# EAGLE schematic Led_Cube_v15 (EAGLE 9.7.0)
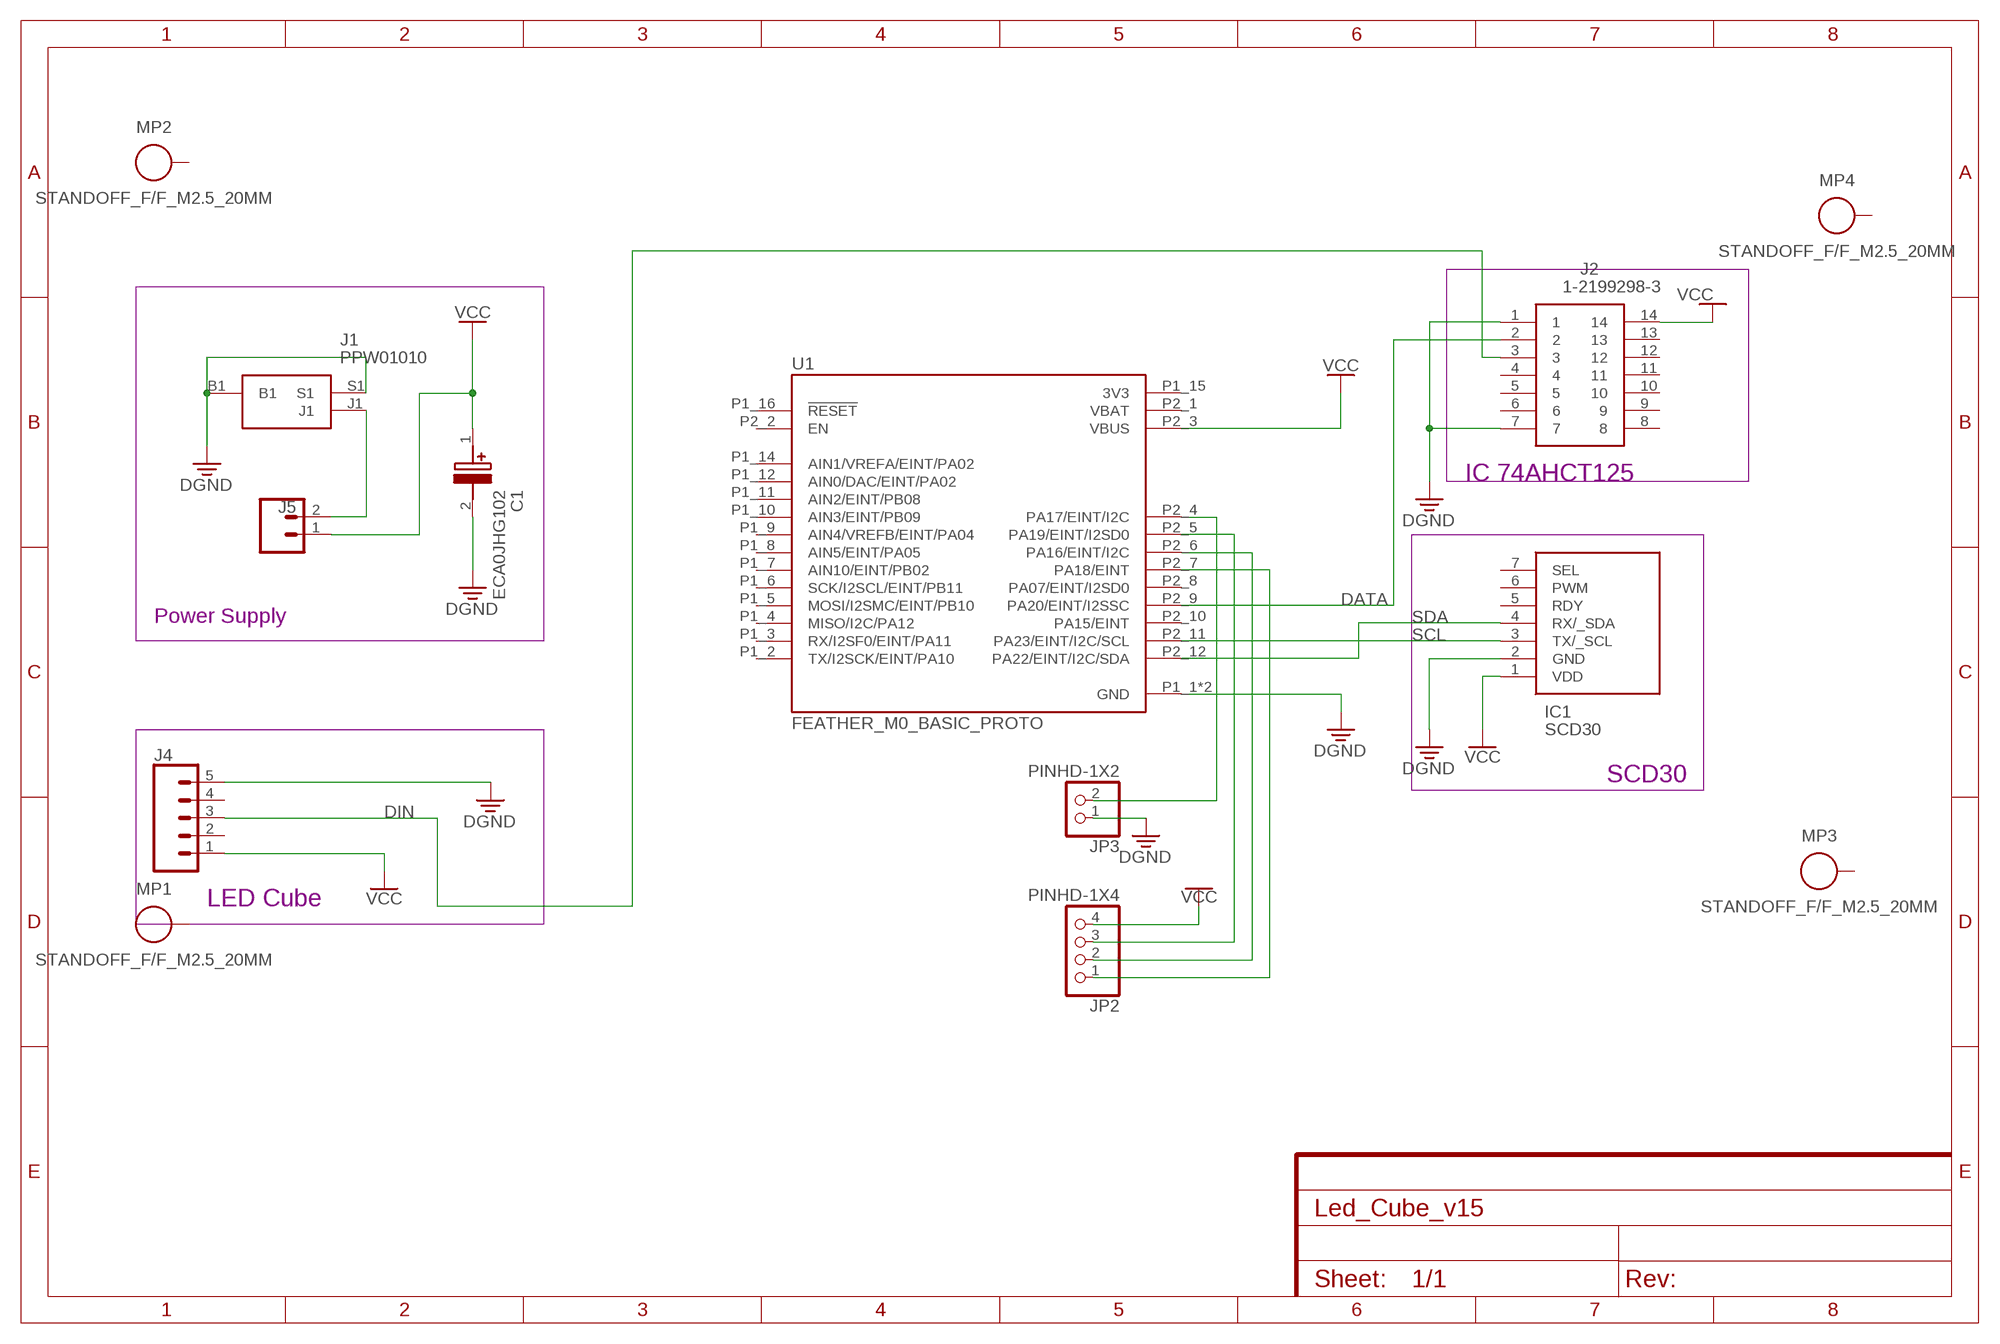
[diagram p0: schematic, sheet 1]

## Parts
C1  ECA0JHG102  [CAPPRD350W65D800H1250]
IC1  SCD30  [SCD30]
J1  PPW01010  [PPW01010]
J2  1-2199298-3  [DIPS762W70P254L1778H510Q14N]
J4  CONN_05PTH  [1X05]
J5  CONN_02  [1X02]
JP2  PINHD-1X4  [1X04]
JP3  PINHD-1X2  [1X02]
MP1  STANDOFF_F/F_M2.5_20MM  [STANDOFF_HEX_FEMALE_500X2000_M2.5X0.45_MTGP755H270]
MP2  STANDOFF_F/F_M2.5_20MM  [STANDOFF_HEX_FEMALE_500X2000_M2.5X0.45_MTGP755H270]
MP3  STANDOFF_F/F_M2.5_20MM  [STANDOFF_HEX_FEMALE_500X2000_M2.5X0.45_MTGP755H270]
MP4  STANDOFF_F/F_M2.5_20MM  [STANDOFF_HEX_FEMALE_500X2000_M2.5X0.45_MTGP755H270]
U1  FEATHER_M0_BASIC_PROTO  [MODULE_FEATHER_M0_BASIC_PROTO]

## Nets
BLUE: JP2.3 U1.P2_5(PA19/EINT/I2SD0)
DATA: J2.2 U1.P2_9(PA20/EINT/I2SSC)
DGND: C1.2(-) IC1.2(GND) J1.B1 J1.S1 J2.1 J2.7 J4.5 JP3.1 U1.P1_1(GND) U1.P1_13(GND)
DIN: J2.3 J4.3
GREEN: JP2.2 U1.P2_6(PA16/EINT/I2C)
N$4: J1.J1 J5.2
RED: JP2.1 U1.P2_7(PA18/EINT)
SCL: IC1.3(TX/_SCL) U1.P2_11(PA23/EINT/I2C/SCL)
SDA: IC1.4(RX/_SDA) U1.P2_12(PA22/EINT/I2C/SDA)
SW1: JP3.2 U1.P2_4(PA17/EINT/I2C)
VCC: C1.1(+) IC1.1(VDD) J2.14 J4.1 J5.1 JP2.4 U1.P2_3(VBUS)
Unconnected: IC1.5(RDY) IC1.6(PWM) IC1.7(SEL) J2.4 J2.5 J2.6 J2.8 J2.9 J2.10 J2.11 J2.12 J2.13 J4.2 J4.4 MP1.1 MP2.1 MP3.1 MP4.1 U1.P1_2(TX/I2SCK/EINT/PA10) U1.P1_3(RX/I2SF0/EINT/PA11) U1.P1_4(MISO/I2C/PA12) U1.P1_5(MOSI/I2SMC/EINT/PB10) U1.P1_6(SCK/I2SCL/EINT/PB11) U1.P1_7(AIN10/EINT/PB02) U1.P1_8(AIN5/EINT/PA05) U1.P1_9(AIN4/VREFB/EINT/PA04) U1.P1_10(AIN3/EINT/PB09) U1.P1_11(AIN2/EINT/PB08) U1.P1_12(AIN0/DAC/EINT/PA02) U1.P1_14(AIN1/VREFA/EINT/PA02) U1.P1_16(!RESET) U1.P2_2(EN) U1.P2_8(PA07/EINT/I2SD0) U1.P2_10(PA15/EINT)

## Notes on the sheet
- IC 74AHCT125
- Power Supply
- SCD30
- LED Cube

## Power pins joined to a net without a drawn wire
3V3: U1.P1_15(3V3)
VBAT: U1.P2_1(VBAT)

## Library data of the parts
C1 = Library:ECA0JHG102: Panasonic 1000F 6.3V dc Aluminium Electrolytic Capacitor, Through Hole 8 (Dia.) x 11.5mm +105C 8mm 3.5mm Source: Datasheet <http://industrial.panasonic.com/cdbs/www-data/pdf/RDF0000/ABA0000C1215.pdf>; DESCRIPTION: Panasonic 1000F 6.3V dc Aluminium Electrolytic Capacitor, Through Hole 8 (Dia.) x 11.5mm +105C 8mm 3.5mm; HEIGHT: 12.5mm; MANUFACTURER_NAME: Panasonic; MANUFACTURER_PART_NUMBER: ECA0JHG102
IC1 = SCD30:SCD30: SENSIRION - SCD30 - GAS SENSOR, CO2, 0.075A/5.5V, 40000PPM Source: Datasheet; DESCRIPTION: SENSIRION - SCD30 - GAS SENSOR, CO2, 0.075A/5.5V, 40000PPM; HEIGHT: 7mm; MANUFACTURER_NAME: Sensirion; MANUFACTURER_PART_NUMBER: SCD30
J1 = PPW01010:PPW01010: PRO POWER - PPW01010 - DC Power Connector, Receptacle, 2.1 mm, PCB Mount, Solder Source: Datasheet; DESCRIPTION: PRO POWER - PPW01010 - DC Power Connector, Receptacle, 2.1 mm, PCB Mount, Solder; HEIGHT: 11.3mm; MANUFACTURER_NAME: PRO POWER; MANUFACTURER_PART_NUMBER: PPW01010
J2 = 7 Dip IC Socket:1-2199298-3: 2.54mm low profile THT DIL socket,14 way TE Connectivity 1-2199298 2.54mm Pitch Straight 14 Way, Through Hole Standard Pin Ladder IC Dip Socket, 1A Source: Datasheet <https://componentsearchengine.com/Datasheets/2/1-2199298-3.pdf>; DESCRIPTION: 2.54mm low profile THT DIL socket,14 way TE Connectivity 1-2199298 2.54mm Pitch Straight 14 Way, Through Hole Standard Pin Ladder IC Dip Socket, 1A; HEIGHT: 5.1mm; MANUFACTURER_NAME: TE Connectivity; MANUFACTURER_PART_NUMBER: 1-2199298-3
J4 = SparkFun-Connectors:CONN_05: Multi connection point. Often used as Generic Header-pin footprint for 0.1 inch spaced/style header connections On any of the 0.1 inch spaced packages, you can populate with these: Break Away Headers - Straight <https://www.sparkfun.com/products/116> (PRT-00116) Break Away Male Headers - Right Angle <https://www.sparkfun.com/products/553> (PRT-00553) Female Headers <https://www.sparkfun.com/products/115> (PRT-00115) Break Away Headers - Machine Pin <https://www.sparkfun.com/products/117> (PRT-00117) Break Away Female Headers - Swiss Machine Pin <https://www.sparkfun.com/products/743> (PRT-00743) For SCREWTERMINALS and SPRING TERMINALS visit here: Screw Terimnals on SparkFun.com <https://www.sparkfun.com/search/results?term=Screw+Terminals> (5mm/3.5mm/2.54mm spacing) This device is also useful as a general connection point to wire up your design to another part of your project. Our various solder wires solder well into these plated through hole pads. Hook-Up Wire - Assortment (Stranded, 22 AWG) <https://www.sparkfun.com/products/11375> (PRT-11375) Hook-Up Wire - Assortment (Solid Core, 22 AWG) <https://www.sparkfun.com/products/11367> (PRT-11367) View the entire wire category on our website here <https://www.sparkfun.com/categories/141> Special notes: Molex polarized connector foot print use with SKU : PRT-08231 with associated crimp pins and housings. 1MM SMD Version SKU: PRT-10208
J5 = SparkFun-Connectors:CONN_02: Multi connection point. Often used as Generic Header-pin footprint for 0.1 inch spaced/style header connections On any of the 0.1 inch spaced packages, you can populate with these: Break Away Headers - Straight <https://www.sparkfun.com/products/116> (PRT-00116) Break Away Male Headers - Right Angle <https://www.sparkfun.com/products/553> (PRT-00553) Female Headers <https://www.sparkfun.com/products/115> (PRT-00115) Break Away Headers - Machine Pin <https://www.sparkfun.com/products/117> (PRT-00117) Break Away Female Headers - Swiss Machine Pin <https://www.sparkfun.com/products/743> (PRT-00743) For SCREWTERMINALS and SPRING TERMINALS visit here: Screw Terimnals on SparkFun.com <https://www.sparkfun.com/search/results?term=Screw+Terminals> (5mm/3.5mm/2.54mm spacing) This device is also useful as a general connection point to wire up your design to another part of your project. Our various solder wires solder well into these plated through hole pads. Hook-Up Wire - Assortment (Stranded, 22 AWG) <https://www.sparkfun.com/products/11375> (PRT-11375) Hook-Up Wire - Assortment (Solid Core, 22 AWG) <https://www.sparkfun.com/products/11367> (PRT-11367) View the entire wire category on our website here <https://www.sparkfun.com/categories/141> Special notes: Molex polarized connector foot print use with: PRT-08233 with associated crimp pins and housings. 2.54_SCREWTERM for use with PRT-10571. 3.5mm Screw Terminal footprints for PRT-08084 5mm Screw Terminal footprints for use with PRT-08432
JP2 = Connector:PINHD-1X4: PIN HEADER; CATEGORY: Headers; DESCRIPTION: Header, Straight, 4 Position; MANUFACTURER: Generic; MPN: Generic; OPERATING_TEMPERATURE: Generic; PART_STATUS: Active; PITCH: 0.100" (2.54mm); ROHS_COMPLIANCE: Generic; SERIES: Generic; SUB-CATEGORY: Headers, Male Pins; TYPE: Board to Board or Cable, Unshrouded, Through Hole, Straight
JP3 = Connector:PINHD-1X2: PIN HEADER; CATEGORY: Headers; DESCRIPTION: Header, Straight, 2 Position; MANUFACTURER: Generic; MPN: Generic; OPERATING_TEMPERATURE: Generic; PART_STATUS: Active; PITCH: 0.100" (2.54mm); ROHS_COMPLIANCE: Generic; SERIES: Generic; SUB-CATEGORY: Headers, Male Pins; TYPE: Board to Board or Cable, Unshrouded, Through Hole, Straight
MP1-MP4 = PCB-Fasteners_Hardware:STANDOFF_F/F: Female-Female Standoff/Spacer with Mounting pad and hole. Essentra : Female Standoff <https://www.essentracomponents.co.in/index.php?option=com_virtuemart&view=productdetails&virtuemart_product_id=14493> The hole and pad sizes may vary based on the application and type of hardware; always verify the Manufacturer specification or Global Standards.; CATEGORY: Standoff/Spacer; SUB-CATEGORY: Female-Female
U1 = feather m0:FEATHER_M0_BASIC_PROTO: ATSAMD21G18 Feather M0 Basic Proto SAM D ARM® Cortex®-M0+ MCU 32-Bit Embedded Evaluation Board Check availability <https://pricing.snapeda.com/parts/Feather%20M0%20Basic%20Proto/Adafruit%20Industries/view-part?ref=eda>; AVAILABILITY: Not in stock; CHECK_PRICES: https://www.snapeda.com/parts/Feather%20M0%20Basic%20Proto/Adafruit+Industries/view-part/?ref=eda; DESCRIPTION: ATSAMD21G18 Feather M0 Basic Proto series ARM® Cortex®-M0+ MCU 32-Bit Embedded Evaluation Board; MF: Adafruit Industries; MP: Feather M0 Basic Proto; PACKAGE: None; PRICE: None; SNAPEDA_LINK: https://www.snapeda.com/parts/Feather%20M0%20Basic%20Proto/Adafruit+Industries/view-part/?ref=snap